# EAGLE design CargadorMonitor (EAGLE 7.7.0)
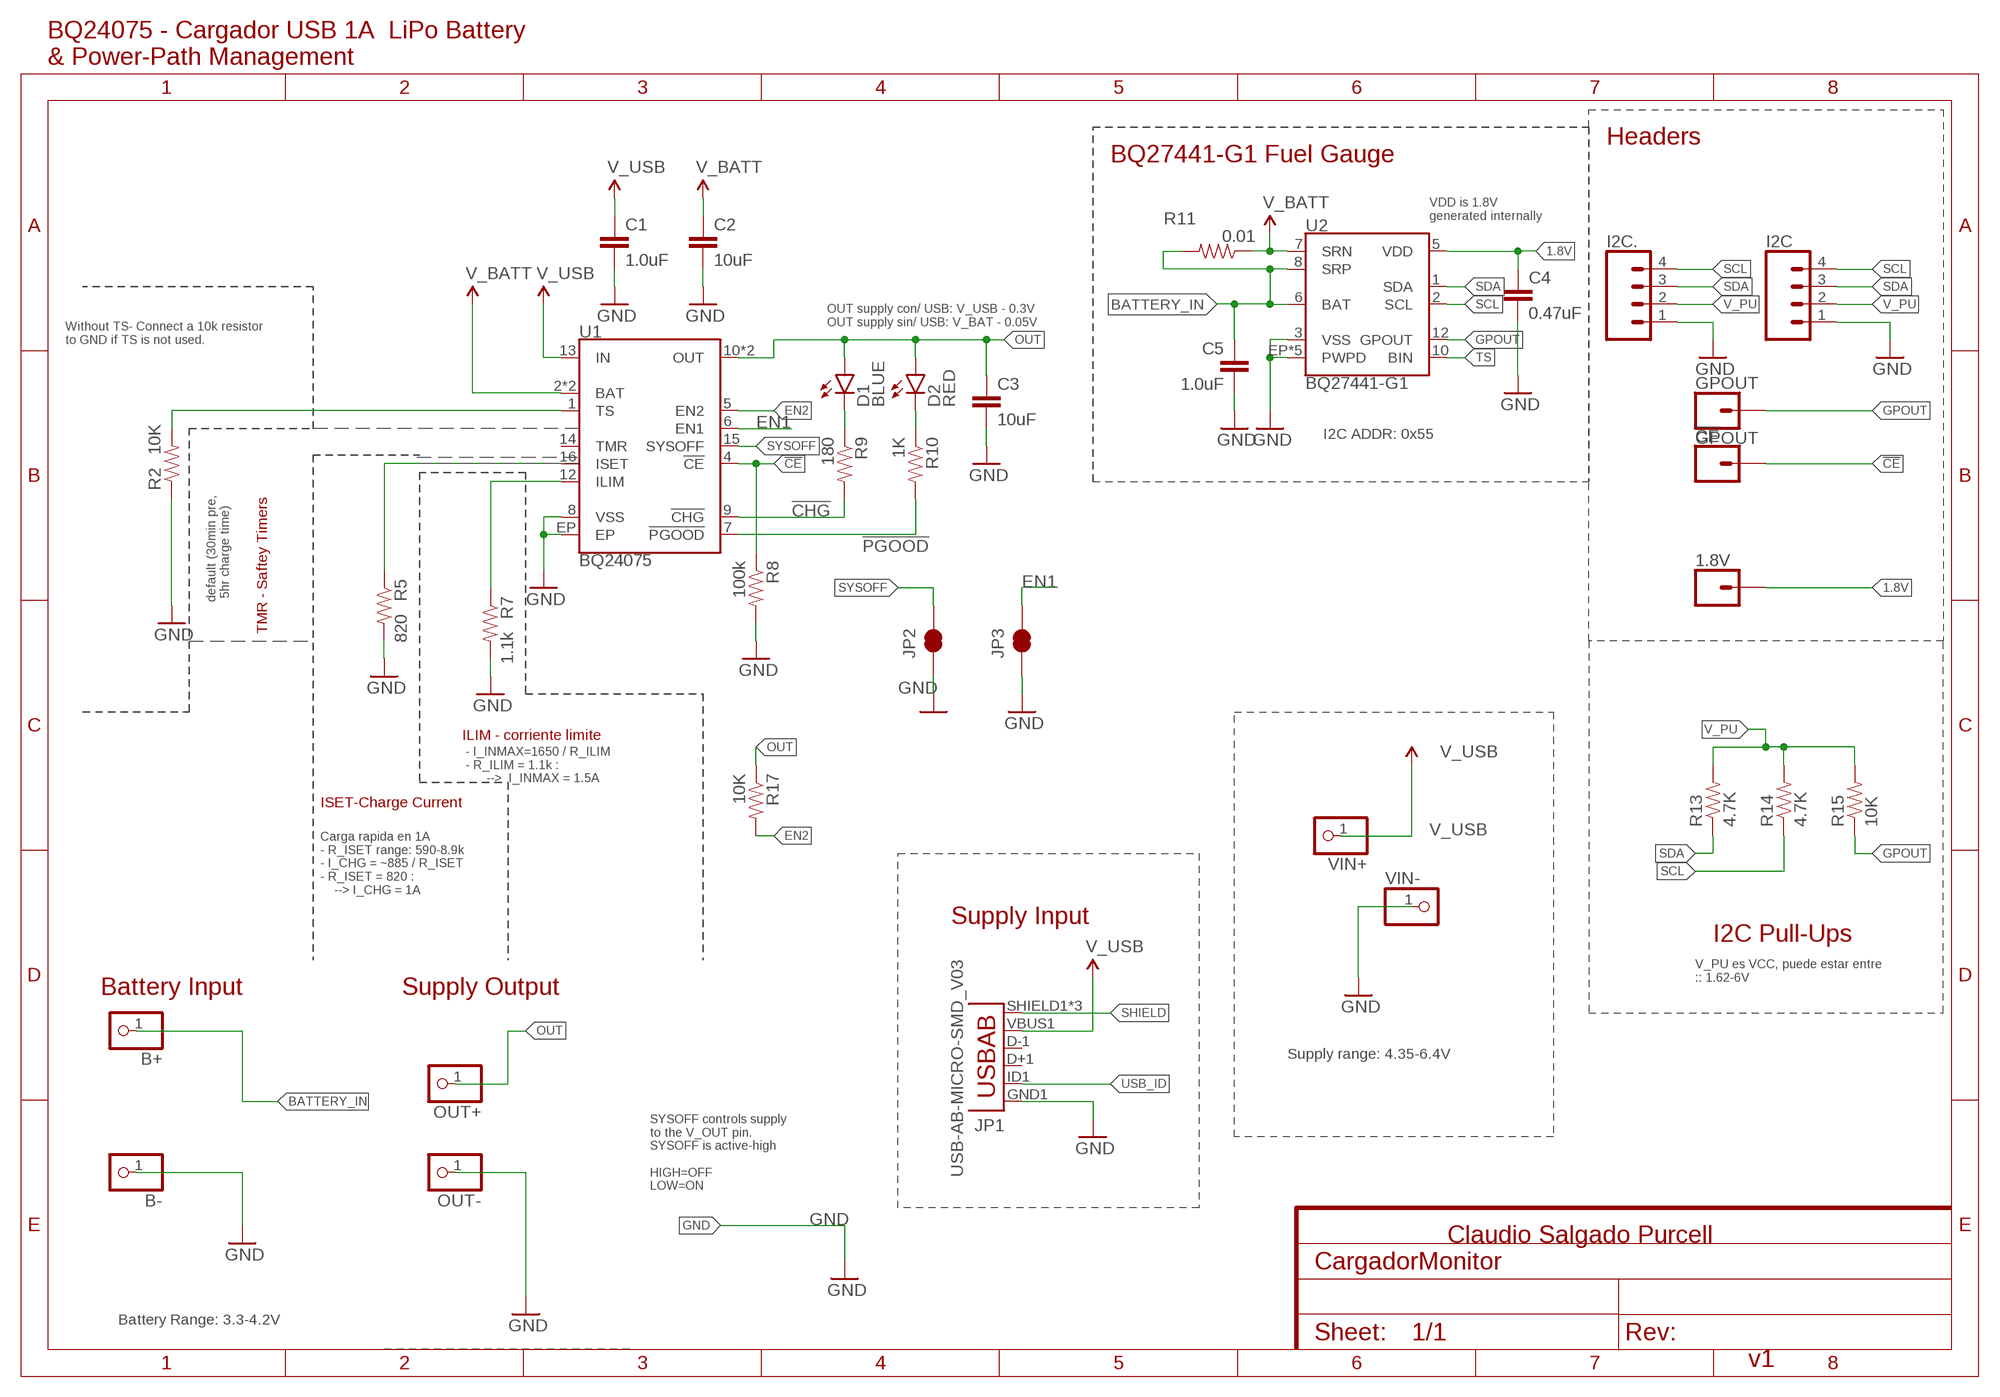
[diagram p0: schematic, sheet 1]

## Parts
1.8V  CONN_01PTH_NO_SILK_SMALL  [1X01_SMALL]
!CE!  CONN_01PTH_NO_SILK_SMALL  [1X01_SMALL]
B+  PINHD-1X1  [1X01]
B-  PINHD-1X1  [1X01]
C1  1.0uF  1.0UF50V10%(1206)  [1206-CAP]
C2  10uF  10UF10V10%(0805)  [0805-CAP]
C3  10uF  10UF10V10%(0805)  [0805-CAP]
C4  0.47uF  CAP0603-CAP  [0603-CAP]
C5  1.0uF  1.0UF-16V-10%(0603)  [0603-CAP]
D1  BLUE  LED-BLUE0603  [LED-0603]
D2  RED  LED-RED0603  [LED-0603]
GPOUT  GPOUT  CONN_01PTH_NO_SILK_SMALL  [1X01_SMALL]
I2C  CONN_04SMD2  [JST04_1MM_RA]
I2C.  CONN_041.27MM  [1X04_1.27MM]
JP1  USB-AB-MICRO-SMD_V03  USB-ABCONN-11794  [USB-AB-MICRO-SMD_V03]
JP2  JUMPER-SMT_2_NC_TRACE_SILK  [SMT-JUMPER_2_NC_TRACE_SILK]
JP3  JUMPER-SMT_2_NC_TRACE_SILK  [SMT-JUMPER_2_NC_TRACE_SILK]
OUT+  PINHD-1X1  [1X01]
OUT-  PINHD-1X1  [1X01]
R2  10K  10KOHM-1/10W-1%(0603)0603  [0603-RES]
R5  820  RESISTOR0603-RES  [0603-RES]
R7  1.1k  RESISTOR0603-RES  [0603-RES]
R8  100k  100KOHM-1/10W-1%(0603)  [0603-RES]
R9  180  180OHM1/10W1%(0603)  [0603-RES]
R10  1K  1KOHM-1/10W-1%(0603)  [0603-RES]
R11  0.01  RESISTOR1206  [1206]
R13  4.7K  4.7KOHM-1/10W-1%(0603)  [0603-RES]
R14  4.7K  4.7KOHM-1/10W-1%(0603)  [0603-RES]
R15  10K  10KOHM-1/10W-1%(0603)0603  [0603-RES]
R17  10K  10KOHM-1/10W-1%(0603)0603  [0603-RES]
U1  BQ24075  [PVQFN-N16]
U2  BQ27441-G1  [PDSO-N12]
VIN+  PINHD-1X1  [1X01]
VIN-  PINHD-1X1  [1X01]

## Nets
1.8V: 1.8V.P$1 C4.1 U2.5(VDD)
!CE!: !CE!.P$1 R8.1 U1.4(!CE!)
!CHG!: R9.2 U1.9(!CHG!)
!PGOOD!: R10.2 U1.7(!PGOOD!)
BATTERY_IN: B+.1 C5.1 R11.2 U2.6(BAT) U2.8(SRP)
EN1: JP3.2 U1.6(EN1)
EN2: R17.2 U1.5(EN2)
GND: B-.1 C1.2 C2.2 C3.2 C4.2 C5.2 I2C.1 I2C..1 JP1.GND1(GND) JP2.1 JP3.1 OUT-.1 R2.1 R5.2 R7.2 R8.2 U1.8(VSS) U1.EP U2.3(VSS) U2.EP1(PWPD) U2.EP2(PWPD) U2.EP3(PWPD) U2.EP4(PWPD) U2.EP(PWPD) VIN-.1
GPOUT: GPOUT.P$1 R15.1 U2.12(GPOUT)
ILIM: R7.1 U1.12(ILIM)
ISET: R5.1 U1.16(ISET)
N$11: D1.C R9.1
N$12: D2.C R10.1
OUT: C3.1 D1.A D2.A OUT+.1 R17.1 U1.10(OUT) U1.11(OUT)
SCL: I2C.4 I2C..4 R14.1 U2.2(SCL)
SDA: I2C.3 I2C..3 R13.1 U2.1(SDA)
SHIELD: JP1.SHIELD1(SHIELD) JP1.SHIELD2(SHIELD) JP1.SHIELD3(SHIELD)
SYSOFF: JP2.2 U1.15(SYSOFF)
TS: R2.2 U1.1(TS) U2.10(BIN)
USB_ID: JP1.ID1(USBID)
V_BATT: C2.1 R11.1 U1.2(BAT) U1.3(BAT) U2.7(SRN)
V_PU: I2C.2 I2C..2 R13.2 R14.2 R15.2
V_USB: C1.1 JP1.VBUS1(VBUS) U1.13(IN) VIN+.1
Unconnected: JP1.D+1(D+) JP1.D-1(D-) U1.14(TMR)

## Notes on the sheet
- BQ24075 - Cargador USB 1A  LiPo Battery  
  & Power-Path Management
- Headers
- BQ27441-G1 Fuel Gauge
- VDD is 1.8V
  generated internally
- OUT supply con/ USB: V_USB - 0.3V
  OUT supply sin/ USB: V_BAT - 0.05V
- Without TS- Connect a 10k resistor 
  to GND if TS is not used.
- I2C ADDR: 0x55
- default (30min pre, 
    5hr charge time)
- TMR - Saftey Timers
- ILIM - corriente limite
- - I_INMAX=1650 / R_ILIM
  - R_ILIM = 1.1k : 
        -->  I_INMAX = 1.5A
- ISET-Charge Current
- Carga rapida en 1A
  - R_ISET range: 590-8.9k
  - I_CHG = ~885 / R_ISET
  - R_ISET = 820 : 
      --> I_CHG = 1A
- Supply Input
- I2C Pull-Ups
- V_PU es VCC, puede estar entre
  :: 1.62-6V
- Battery Input | Supply Output
- Supply range: 4.35-6.4V
- SYSOFF controls supply 
  to the V_OUT pin.
  SYSOFF is active-high
  
  HIGH=OFF
  LOW=ON
- Claudio Salgado Purcell
- Battery Range: 3.3-4.2V
- v1

## Library data of the parts
1.8V !CE! GPOUT = SparkFun-Connectors:CONN_01: Single connection point. Often used as Generic Header-pin footprint for 0.1 inch spaced/style header connections On any of the 0.1 inch spaced packages, you can populate with these: Break Away Headers - Straight <https://www.sparkfun.com/products/116> (PRT-00116) Break Away Male Headers - Right Angle <https://www.sparkfun.com/products/553> (PRT-00553) Female Headers <https://www.sparkfun.com/products/115> (PRT-00115) Break Away Headers - Machine Pin <https://www.sparkfun.com/products/117> (PRT-00117) Break Away Female Headers - Swiss Machine Pin <https://www.sparkfun.com/products/743> (PRT-00743) This device is also useful as a general connection point to wire up your design to another part of your project. Our various solder wires solder well into these plated through hole pads. Hook-Up Wire - Assortment (Stranded, 22 AWG) <https://www.sparkfun.com/products/11375> (PRT-11375) Hook-Up Wire - Assortment (Solid Core, 22 AWG) <https://www.sparkfun.com/products/11367> (PRT-11367) View the entire wire category on our website here <https://www.sparkfun.com/categories/141> Special notes: SMTSO-256-ET is a "flush mount" nut for a 4-40 screw. We mostly use this on specialty testbeds; it is a nice way to connect hardware to your PCB at an adjustable hieght. Also note, the SNAP packages are for using a snappable style connector. We sell a baggie of snaps and they are also used on two LilyPad designs: Snap Assortment - 30 pack (male and female) <https://www.sparkfun.com/products/11347> (DEV-11347) LilyPad Arduino SimpleSnap <https://www.sparkfun.com/products/10941> (DEV-10941) LilyPad SimpleSnap Protoboard <https://www.sparkfun.com/products/10940> (DEV-10940)
B+ B- OUT+ OUT- VIN+ VIN- = adafruit:PINHD-1X1: Pin header 1x1 for 0.1" spacing With round pins
C1 = SparkFun-Capacitors:1.0UF50V10%(1206): CAP-09822; PROD_ID: CAP-09822
C2 C3 = SparkFun-Capacitors:10UF10V10%(0805): CAP-11330; PROD_ID: CAP-11330
C4 = SparkFun-Capacitors:CAP: Capacitor Standard 0603 ceramic capacitor, and 0.1" leaded capacitor.; PROD_ID: CAP-13216
C5 = SparkFun-Capacitors:1.0UF-16V-10%(0603): CAP-00868; PROD_ID: CAP-00868
D1 = SparkFun-LED:LED-BLUE: Blue LEDs for production use Various blue LEDs stocked by SparkFun production 0603 - DIO-08575 Rebel - DIO-09553 1206 - DIO-09911; PROD_ID: DIO-08575
D2 = SparkFun-LED:LED-RED: Assorted Red LEDs LilyPad 1206- DIO-09912 1206- DIO-00809 0603- DIO-00819 "SMART" means more efficient and expensive; PROD_ID: DIO-00819
I2C = SparkFun-Connectors:CONN_04: Multi connection point. Often used as Generic Header-pin footprint for 0.1 inch spaced/style header connections On any of the 0.1 inch spaced packages, you can populate with these: Break Away Headers - Straight <https://www.sparkfun.com/products/116> (PRT-00116) Break Away Male Headers - Right Angle <https://www.sparkfun.com/products/553> (PRT-00553) Female Headers <https://www.sparkfun.com/products/115> (PRT-00115) Break Away Headers - Machine Pin <https://www.sparkfun.com/products/117> (PRT-00117) Break Away Female Headers - Swiss Machine Pin <https://www.sparkfun.com/products/743> (PRT-00743) For SCREWTERMINALS and SPRING TERMINALS visit here: Screw Terimnals on SparkFun.com <https://www.sparkfun.com/search/results?term=Screw+Terminals> (5mm/3.5mm/2.54mm spacing) This device is also useful as a general connection point to wire up your design to another part of your project. Our various solder wires solder well into these plated through hole pads. Hook-Up Wire - Assortment (Stranded, 22 AWG) <https://www.sparkfun.com/products/11375> (PRT-11375) Hook-Up Wire - Assortment (Solid Core, 22 AWG) <https://www.sparkfun.com/products/11367> (PRT-11367) View the entire wire category on our website here <https://www.sparkfun.com/categories/141> Special notes: Molex polarized connector foot print use with SKU : PRT-08231 with associated crimp pins and housings. 1MM SMD Version SKU: PRT-10208; PROD_ID: CONN-10310; SF_ID: PRT-10208
I2C. = SparkFun-Connectors:CONN_04: Multi connection point. Often used as Generic Header-pin footprint for 0.1 inch spaced/style header connections On any of the 0.1 inch spaced packages, you can populate with these: Break Away Headers - Straight <https://www.sparkfun.com/products/116> (PRT-00116) Break Away Male Headers - Right Angle <https://www.sparkfun.com/products/553> (PRT-00553) Female Headers <https://www.sparkfun.com/products/115> (PRT-00115) Break Away Headers - Machine Pin <https://www.sparkfun.com/products/117> (PRT-00117) Break Away Female Headers - Swiss Machine Pin <https://www.sparkfun.com/products/743> (PRT-00743) For SCREWTERMINALS and SPRING TERMINALS visit here: Screw Terimnals on SparkFun.com <https://www.sparkfun.com/search/results?term=Screw+Terminals> (5mm/3.5mm/2.54mm spacing) This device is also useful as a general connection point to wire up your design to another part of your project. Our various solder wires solder well into these plated through hole pads. Hook-Up Wire - Assortment (Stranded, 22 AWG) <https://www.sparkfun.com/products/11375> (PRT-11375) Hook-Up Wire - Assortment (Solid Core, 22 AWG) <https://www.sparkfun.com/products/11367> (PRT-11367) View the entire wire category on our website here <https://www.sparkfun.com/categories/141> Special notes: Molex polarized connector foot print use with SKU : PRT-08231 with associated crimp pins and housings. 1MM SMD Version SKU: PRT-10208
JP1 = SparkFun-Connectors:USB-AB: This is a USB AB connector that is compatible with USB OTG. i.e. this connector can serve as a host or device; PROD_ID: CONN-11794
JP2 JP3 = SparkFun-Jumpers:JUMPER-SMT_2_NC_TRACE: Normally closed trace jumper This jumper has a trace between two pads so it's normally closed (NC). Use a razor knife to open the connection. For best results follow the IPC guidelines for cutting traces: Cutout at least 0.063 mm (0.005 in). Remove all loose material to clean up the cut area. Seal the cut with an approved epoxy. Reapply solder to reclose the connection.
R2 R15 R17 = SparkFun-Resistors:10KOHM-1/10W-1%(0603): RES-00824; PROD_ID: RES-00824
R5 = SparkFun-Passives:RESISTOR: Resistor Basic schematic elements and footprints for 0603, 1206, and PTH resistors.; PROD_ID: RES-13217
R7 = SparkFun-Passives:RESISTOR: Resistor Basic schematic elements and footprints for 0603, 1206, and PTH resistors.; PROD_ID: RES-10447
R8 = SparkFun-Resistors:100KOHM-1/10W-1%(0603): RES-07828; PROD_ID: RES-07828
R9 = SparkFun-Resistors:180OHM1/10W1%(0603): RES-08788; PROD_ID: RES-08788
R10 = SparkFun-Resistors:1KOHM-1/10W-1%(0603): RES-07856; PROD_ID: RES-07856
R11 = SparkFun-Resistors:RESISTOR: Resistor Basic schematic elements and footprints for 0603, 1206, and PTH resistors.; PROD_ID: RES-13218
R13 R14 = SparkFun-Resistors:4.7KOHM-1/10W-1%(0603): RES-07857; PROD_ID: RES-07857
U1 = SparkFun-PowerIC:BQ24075: Texas Instruments BQ24075 LiPo Battery Chargerand Power-Path Management IC The bq2407x series of devices are integrated Li-Ion linear chargers and system power path management devices targeted at space-limited portable applications. The devices operate from either a USB port or an AC adapter and support charge currents up to 1.5 A. The input voltage range with input overvoltage protection supports unregulated adapters. The USB input current limit accuracy and start up sequence allow the bq2407x to meet USB-IF inrush current specifications. Additionally, the input dynamic power management (VIN-DPM) prevents the charger from crashing incorrectly configured USB sources. Datasheet <http://www.ti.com/product/BQ24075/datasheet> SparkFun Products SparkFun Battery Babysitter <https://www.sparkfun.com/products/13777> (PRT-13777); PROD_ID: IC-13219
U2 = SparkFun-PowerIC:BQ27441-G1: Texas Instruments BQ27441-G1 LiPo Battery Fuel Gauge The Texas Instruments bq27441-G1 fuel gauge is a microcontroller peripheral that provides system-side fuel gauging for single-cell Li-Ion batteries. The device requires minimal user configuration and system microcontroller firmware development. The bq27441-G1 battery fuel gauge uses the patented Impedance Track™ algorithm for fuel gauging, and provides information such as remaining battery capacity (mAh), state-of-charge (%), and battery voltage (mV). Datasheet <http://www.ti.com/product/BQ27441-G1/datasheet> SparkFun Products SparkFun Battery Babysitter <https://www.sparkfun.com/products/13777> (PRT-13777); PROD_ID: IC-13220

## Board
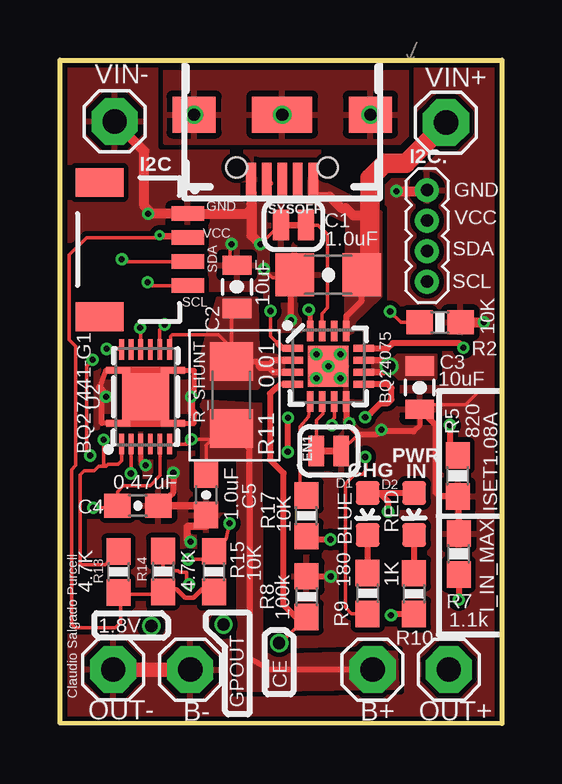
[diagram p1: board, top side]
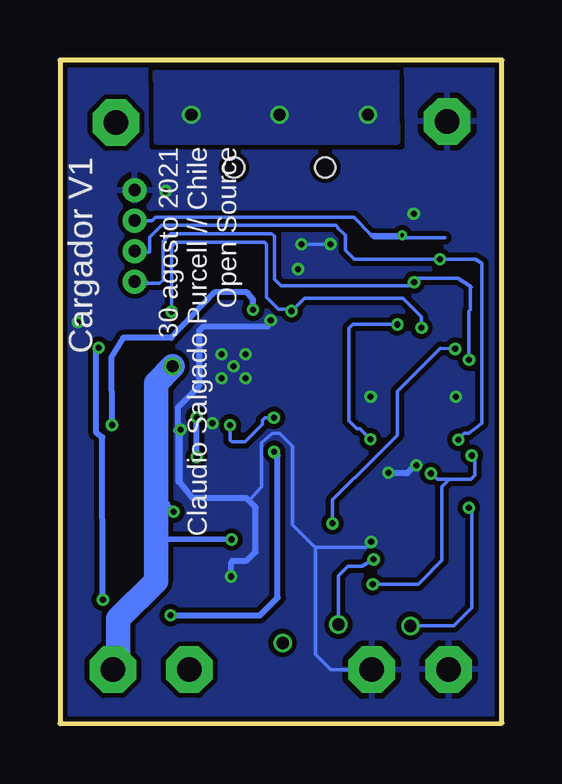
[diagram p2: board, bottom side, seen from below]

Size 18.43 x 27.65 mm. Coordinates in mm from the lower left corner, seen from the top.
Outline: 0,27.65 18.43,27.65 18.43,0 0,0.02 0,27.65
Copper layers (1*16): Top 0.035mm / dielectric 1.5mm / Bottom 0.035mm
Design rules "SparkFun-2-layer-FAB-LIMIT *": minimum track width 7mil, minimum drill 6mil, track to track 7mil, track to pad 7mil, pad to pad 7mil, via to via 7mil, smd to smd 7mil, copper to edge 7mil, drill to drill 7mil, minimum pad ring 5mil, minimum via ring 5mil, stop-mask expansion 4mil, vias tented up to drill 20mil, thermal gap 10mil

### Footprints (pad centres in the part's own frame; a part is rotated, then mirrored left to right if it is on the bottom)
1X01_SMALL = drill 0.508: P$1 0,0
1X01 = drill 1.016 pad 1.93 octagon: 1 0,0
1206-CAP = smd 1.6 x 1.8: 1 -1.4,0; 2 1.4,0
0805-CAP = smd 0.8 x 1.2: 1 -0.9,0; 2 0.9,0
0603-CAP = smd 1.1 x 1: 1 -0.85,0; 2 0.85,0
LED-0603 = smd 1 x 1: A 0,-0.877; C 0,0.877
JST04_1MM_RA = smd 0.6 x 1.35: 1 -1.5,0; 2 -0.5,0; 3 0.5,0; 4 1.5,0 | smd 1.2 x 2: NC1 2.8,-3.675; NC2 -2.8,-3.675
1X04_1.27MM = drill 0.508 pad 1: 1 0,0; 2 1.27,0; 3 2.54,0; 4 3.81,0
USB-AB-MICRO-SMD_V03 = smd 1.4 x 0.4: D+1 2.7,0; D-1 2.7,0.65; GND1 2.7,-1.3; ID1 2.7,-0.65; VBUS1 2.7,1.3 | smd 1.5 x 1.8: SHIELD1 0,3.68; SHIELD3 0,-3.68 | smd 1.5 x 2.5: SHIELD2 0,0 | hole 0.85: 2.2,1.9; 2.2,-1.9
SMT-JUMPER_2_NC_TRACE_SILK = smd 0.66 x 1.27: 1 -0.521,0; 2 0.521,0
0603-RES = smd 1.1 x 1: 1 -0.85,0; 2 0.85,0
1206 = smd 1.6 x 1.8: 1 -1.4,0; 2 1.4,0
PVQFN-N16 = smd 0.28 x 0.85: 1 -0.75,-1.475; 2 -0.25,-1.475; 3 0.25,-1.475; 4 0.75,-1.475; 9 0.75,1.475; 10 0.25,1.475; 11 -0.25,1.475; 12 -0.75,1.475 | smd 0.85 x 0.28: 5 1.475,-0.75; 6 1.475,-0.25; 7 1.475,0.25; 8 1.475,0.75; 13 -1.475,0.75; 14 -1.475,0.25; 15 -1.475,-0.25; 16 -1.475,-0.75 | smd 1.7 x 1.7: EP 0,0
PDSO-N12 = smd 0.2 x 0.85: 1 -1,-1.975; 2 -0.6,-1.975; 3 -0.2,-1.975; 4 0.2,-1.975; 5 0.6,-1.975; 6 1,-1.975; 7 1,1.975; 8 0.6,1.975; 9 0.2,1.975; 10 -0.2,1.975; 11 -0.6,1.975; 12 -1,1.975 | smd 1.95 x 1.95: EP 0,0 | smd 1 x 0.25: EP1 -1.15,1.1; EP2 -1.15,-1.1; EP3 1.15,-1.1; EP4 1.15,1.1

### Placement (x,y rotation side)
1.8V  3.81,4.07 0 top
!CE!  9.14,3.36 0 top
B+  13.04,2.25 0 top
B-  5.43,2.25 0 top
C1  11.19,18.7 180 top
C2  7.38,18.2 90 top
C3  15,14 270 top
C4  3.25,9.08 0 top
C5  6.1,9.54 270 top
D1  12.83,8.73 180 top
D2  14.77,8.73 180 top
GPOUT  6.82,4.13 0 top
I2C  5.33,19.75 270 top
I2C.  15.31,22.23 270 top
JP1  9.27,25.37 270 top
JP2  9.74,20.77 0 top
JP3  11.21,11.36 180 top
OUT+  16.22,2.25 0 top
OUT-  2.22,2.26 0 top
R2  15.85,16.71 180 top
R5  16.59,10.32 270 top
R7  16.62,7.07 90 top
R8  10.29,5.29 90 top
R9  12.83,5.43 270 top
R10  14.77,5.42 270 top
R11  7.15,13.7 270 top
R13  2.44,6.32 270 top
R14  4.3,6.34 270 top
R15  6.42,6.33 270 top
R17  10.28,8.66 90 top
U1  11.19,14.89 270 top
U2  3.57,13.62 0 top
VIN+  16.1,25.04 0 top
VIN-  2.28,25.09 0 top

### Tracks (layer width: path | path; a pad name or v marks a point on that pad's centre or on a via)
1.8V  (via drill 0.25)
  Top 0.15: U2.5 4.18,10.34 3.75,9.91 2.64,9.91 2.4,9.67 C4.1 2.32,9 v1.38,9
  Bottom 0.15: 1.8V.P$1 2,4.07 1.25,4.82 1.25,8.97 v1.38,9
!CE!
  Top 0.15: !CE!.P$1 9.32,3.47 R8.1
  Top 0.203: U1.4 9.17,14.14 9.03,14
  Top 0.254: 9.03,14 8.97,13.94 8.95,13.94 8.76,13.75 8.76,11 9.33,10.43 | R8.1 9.84,4.44 9.33,4.95 9.33,10.43 | 9.33,10.43 9.34,10.44
!CHG!  (via drill 0.25)
  Top 0.15: R9.2 12.17,4.58 11.9,4.84 11.9,10 12.3,10.4 12.61,10.4 12.76,10.55 12.76,11.08 v12.73,11.11 12.83,10.99
  Top 0.254: v12.73,12.77 12.95,12.93 13.37,13.35 13.68,13.35 13.83,13.5 13.83,13.99 13.68,14.14 U1.9
  Bottom 0.254: v12.73,11.11 v12.73,12.77
!PGOOD!  (via drill 0.25)
  Top 0.15: v11.34,12.43 11.34,12.63 11.45,12.74 U1.7
  Top 0.254: R10.2 13.99,4.56 v13.81,4.51 | v9.5,11.32 9.5,12.54 v9.51,12.75
  Bottom 0.15: v9.51,12.75 9.87,12.75 9.98,12.64 9.98,12.47 10.71,11.74 11.26,11.74 11.33,11.81 v11.33,12.42 v11.34,12.43
  Bottom 0.254: v13.81,4.51 10.09,4.51 9.35,5.25 9.35,11.17 v9.5,11.32
BATTERY_IN  (via drill 0.25)
  Top 0.15: U2.8 4.15,16.2 4.15,16.42 v4.36,16.63 | U2.6 5.27,11.64 | 5.27,11.64 v5.48,11.85 6.36,11.85 | 6.36,11.85 6.71,11.85 R11.2 | 5.27,11.64 5.27,11.72 5.45,11.9 5.47,11.9 5.5,11.87 5.53,11.87 | C5.1 6.1,11.59 6.36,11.85
  Top 0.254: B+.1 8.77,2.25 7.93,2.7 7.93,9.23 7.9,9.65 7.9,11.45 7.15,12.2 R11.2
  Bottom 0.15: v5.48,11.85 5.92,12.3 6.05,12.3 6.38,12.62 6.38,16.47 6.22,16.63 v4.36,16.63
  pour Top (isolate 0.203, no thermals): 14.07,1.52 14,2.95 8.66,2.81 8.39,3.06 8.37,13.27 5.9,13.41 5.92,11.13 7.45,11.05 7.44,1.41
EN1
  Top 0.15: U1.6 10.96,13.39 10.96,12.91 10.69,12.64 JP3.2
EN2
  Top 0.15: 10.44,9.66 R17.2 | 9.97,9.82 R17.2 | U1.5 10.36,12.79 10.01,12.36 10.01,9.78 R17.2
  Top 0.254: 10.24,9.46 R17.2
GND  (via drill 0.25)
  Top 0.15: 8.09,21.87 7.99,21.27 | VIN-.1 2.28,25.02 | 17.52,13.89 16.91,13.28 15.18,13.28 C3.2 | C2.2 7.31,19.09 7.1,19.31 7.1,19.93 v7.15,19.98 | JP3.1 12.44,12.06 | 11.94,12.68 11.94,12.55 v12.08,12.52 | JP2.1 9.16,20.77 v8.36,19.97 | 9.67,18.58 8.87,18.58 v8.51,18.94
  Top 0.178: 5.6,13.95 5.58,13.95 5.58,13.77 v5.47,13.62 | 15.28,22.15 15.36,22.13 I2C..1
  Top 0.2: 15.26,13.1 C3.2 15,12.42 14.76,12.18
  Top 0.203: U2.EP1 1.9,14.72 1.65,14.01 | U2.EP4 5.6,14.72 5.6,13.95 5.6,13.87 | U2.EP3 5.6,12.52 5.6,12.92 | U2.EP2 1.75,12.52 | U2.3 3.37,10.96 v3.57,10.76
  Top 0.254: U2.EP1 3.57,14.72 | U1.8 11.94,12.68 | R7.2 16.66,7.95 R5.2 15.83,9.47 15.67,9.63 15.67,12.43 C3.2 | 13.6,12.22 v13.4,12.24 | 12.15,12.44 v12.08,12.52 12.02,12.48 12.44,12.06 13.22,12.06 v13.4,12.24 | R8.2 v11.3,6.14 v11.29,6.13 | 10.17,19.47 10.17,19.08 C1.2 9.67,18.58 9.64,18.55 v9.64,16.8 | v4.73,10.45 4.71,9.6 C4.2 | 1.75,12.52 1.75,13.45 v1.92,13.62 | 14.76,12.18 13.46,12.18 v13.4,12.24
  Top 0.305: 1.65,14.01 v1.92,13.62 | v5.47,13.62 5.47,13.05 5.6,12.92 | C4.2 5.71,9.08 C5.2 6.1,8.22 5.35,8.22 5.31,8.18 5.31,7.71 v5.45,7.57
  Top 0.406: JP1.GND1 7.98,21.65 7.99,21.45 | 7.99,21.45 7.99,21.27 7.99,20.34 v8.36,19.97 | VIN-.1 3.52,23.85 3.52,21.57 3.84,21.25 I2C.1 7.78,21.25 7.99,21.45 | R2.1 17.71,16.71 16.62,16.71 | 15.38,22.19 15.38,22.25 15.29,22.25 15.29,22.15 15.28,22.15 15.28,22.16 | v14.03,22.19 15.27,22.19 I2C..1
  Top 0.61: B-.1 OUT-.1
  Top 0.813: 5.77,2.17 B-.1
  Bottom 0.15: v8.36,19.97 7.32,19.97 7.31,19.98 v7.15,19.98 | 7.72,7.35 7.8,7.35 8.73,8.28 8.73,11.55 9.27,12.09 9.56,12.09 10.02,11.7 10.02,9.87 10.54,9.28 | v5.45,7.57 5.67,7.35 7.72,7.35 | 7.72,7.35 7.77,7.3 7.77,2.89 7.13,2.25 B-.1
  Bottom 0.2: 13.54,12.28 v13.4,12.24
  Bottom 0.254: v11.29,6.13 11.29,6.72 11.24,6.79 10.64,6.79 10.27,7.16 10.27,9.01 10.54,9.28 10.66,9.4 12.9,9.4 13.46,10.1 | 13.6,12.22 v13.4,12.24 13.52,12.36 13.52,13.17 12.63,14.06 12.63,16.36 12.44,16.55 9.77,16.55 9.66,16.66 9.66,16.78 v9.64,16.8 | v3.57,10.76 3.63,10.76 3.96,10.43 4.71,10.43 v4.73,10.45
  Bottom 0.305: 13.46,10.1 13.46,12.04 v13.4,12.24
  other vias: 11.19,14.89 11.69,15.39 11.69,14.39 10.69,14.39 10.69,15.39 3.68,21.25 17.68,16.72
  pour Top (isolate 0.203, rank 6): 0.02,27.6 -0.13,0.19 18.36,0 18.51,27.41
  pour Bottom (isolate 0.203, rank 6): 0.03,27.52 0.03,-0.05 18.4,-0.02 18.4,27.55
GPOUT  (via drill 0.25)
  Top 0.15: v7.07,8.34 6.93,7.69 R15.1 | 6.34,7.1 R15.1 | 6.37,7.13 R15.1 | v5.35,6.84 6.08,6.84 R15.1
  Top 0.203: U2.12 v1.95,15.61
  Bottom 0.15: v1.95,15.61 2.57,15.63 4.36,13.84 4.36,12.02 5.23,11.15 5.24,11.15 7.07,9.32 v7.07,8.34 | GPOUT.P$1 6.82,6.16 6.43,6.55 5.83,6.55 v5.35,6.84
ILIM  (via drill 0.25)
  Top 0.254: R7.1 16.62,5.3 v16.64,5.16 | v16.82,15.66 v16.82,15.67 16.64,15.85 13.88,15.85 13.64,15.61 12.69,15.61 U1.12
  Bottom 0.254: v16.64,5.16 16.66,11.94 16.91,12.11 16.91,15.67 v16.82,15.66
ISET  (via drill 0.25)
  Top 0.203: U1.16 10.44,17.18 v10.38,17.24
  Top 0.254: v16.26,12.44 16.26,11.57 R5.1
  Bottom 0.254: v10.38,17.24 10.38,17.66 10.63,17.97 11.99,17.97 13.79,16.07 15.8,16.07 16.29,15.26 16.28,12.46 v16.26,12.44
N$11
  Top 0.254: D1.C R9.1
N$12
  Top 0.254: D2.C R10.1
OUT  (via drill 0.25, 0.51)
  Top 0.254: D1.A 13.33,9.61 | 13.33,9.61 D2.A | R17.1 10.4,7.69 11.1,7.69 v11.28,7.67 | v13.69,8.83 13.69,9.25 13.33,9.61
  Top 0.279: U1.11 13.48,15.14 v13.73,14.89 13.48,14.64 U1.10
  Bottom 0.2: 14.46,11.46 14.43,11.49
  Bottom 0.254: 14.43,8.67 13.96,9.14 13.96,9.1 v13.69,8.83 | v11.28,7.67 14.13,7.68 14.43,7.38
  Bottom 1.016: v13.73,14.89 14.43,14.19 14.43,11.49 14.43,8.67 14.43,7.38 14.43,5.94 16,4.37 16,2.28 OUT+.1
  pour Top (isolate 0.305, no thermals): 13.1,15.27 14.05,15.27 14.17,15.4 15.63,15.4 15.63,14.38 14.11,14.38 13.98,14.51 13.1,14.51
SCL  (via drill 0.25)
  Top 0.15: 1.11,11.1 v1.26,11.17 1.11,11.32 1.11,14.9 v1.37,15.16 | I2C.4 3.8,18.25 v3.66,18.39 | U2.2 2.97,10.69 v2.96,10.42 | R14.1 4.31,6.5 4.32,6.5 4.45,6.37 4.93,6.37 4.99,6.31 5.29,6.31 5.29,5.91 v5.39,5.81
  Bottom 0.15: 2.2,10.18 1.3,10.18 1.13,10.35 1.13,11.04 v1.26,11.17 | 2.2,10.18 2.51,9.87 2.51,6.8 2.95,6.36 2.95,6.35 3.49,5.81 v5.39,5.81 5.18,5.89 | v2.96,10.42 2.7,10.19 2.2,10.18 | 14.86,18.34 14.82,18.34 14.27,18.34 14.13,18.48 14.13,20.1 13.82,20.41 9.6,20.41 9.49,20.3 9.49,18.52 9.22,18.25 3.8,18.25 v3.66,18.39 3.78,18.55 1.83,18.55 1.32,18.23 1.28,18.19 1.31,18.16 1.31,17.24 1.37,17.18 v1.37,15.16
  Bottom 0.178: I2C..4 15.18,18.39 14.82,18.39 14.82,18.34
SDA  (via drill 0.25)
  Top 0.15: v1.82,11.83 1.82,10.82 1.93,10.71 | v2.58,19.35 2.68,19.25 I2C.3 | U2.1 2.57,10.95 2.43,10.81 2.02,10.81 1.93,10.71 | 1.93,10.71 1.61,10.71 1.43,10.54 1,10.54 0.84,10.37 0.84,6.76 0.82,6.62 1.89,6.62 R13.1
  Top 0.254: 2.11,7.5 R13.1
  Bottom 0.15: v1.82,11.83 1.56,12.09 1.38,12.09 0.83,12.51 0.83,19.19 1.1,19.35 v2.58,19.35 6.15,19.35 6.52,19.72 6.52,20.34 6.83,20.65 6.83,20.66 6.93,20.76 14.19,20.76 14.69,20.26 14.69,19.66 14.72,19.63 15.25,19.63 I2C..3
SHIELD  (via drill 0.51)
  other vias: 5.59,25.37 12.95,25.37 9.27,25.37
  pour Bottom (isolate 0.305): 4.4,27.59 4.36,24.21 14.4,24.21 14.44,27.59
  pour Top (isolate 0.305): 14.44,27.59 14.44,24.19 4.4,24.21 4.4,27.61
SYSOFF
  Top 0.15: JP2.2 10.77,20.77 11.16,20.38 11.16,17.32 10.92,17.08 10.92,16.39 U1.15
TS  (via drill 0.25)
  Top 0.15: R2.2 14.22,16.71 v13.77,17.17 | v8.78,17.19 8.78,16.15 9.08,15.85 | U2.10 3.37,16.48 v3.35,16.5
  Top 0.254: U1.1 9.29,15.64 9.08,15.85
  Bottom 0.15: 13.73,17.17 v13.77,17.17 v13.78,17.18 13.78,19.86 13.59,20.05 9.9,20.05 9.81,19.96 9.81,17.76 9.31,17.26 8.85,17.26 v8.78,17.19 8.24,17.73 4.13,17.73 3.35,16.95 v3.35,16.5
USB_ID
  Top 0.203: JP1.ID1 8.79,22.51
V_BATT
  Top 0.15: R11.1 7.15,15.67 | 7.15,15.67 7.15,17.21 C2.1 7.23,17.04 | U2.7 4.61,15.64 4.61,16.14 4.68,16.21 6.61,16.21 7.15,15.67
  Top 0.254: R11.1 8.18,15.09 8.38,14.9
  Top 0.279: U1.2 8.9,15.14 8.65,14.89 8.9,14.64 U1.3
  Top 0.406: 8.65,14.89 8.38,14.9
  pour Top (isolate 0.203, no thermals): 5.93,15.26 6.61,17.71 8.17,17.72 8.22,15.39 9.28,15.33 9.28,14.51 8.49,14.45 8.33,14.47 8.23,14 6.48,13.98 5.93,13.99
V_PU  (via drill 0.15)
  Top 0.15: 2.53,5.38 2.53,4.21 2.31,3.99 0.63,3.99 0.48,4.14 0.48,10.58 0.66,10.76 0.66,15.72 0.39,15.99 0.39,19.54 1.12,20.25 I2C.2 | 2.53,5.38 R13.2 | 2.53,5.38 4.19,5.38 R14.2 | R15.2
  Top 0.178: R15.2 6.29,5.59 5.93,5.59 5.58,5.24 5.22,5.24 4.87,5.59 4.33,5.59 R14.2 | v4.15,20.35 5.22,20.35 I2C.2
  Bottom 0.15: I2C..2 14.58,20.96 14.44,21.1 6.18,21.1 5.42,20.34 I2C.2 2.37,20.25
  Bottom 0.178: v4.15,20.35 5.4,20.35 5.42,20.34
V_USB
  Top 0.254: U1.13 11.94,16.97 12.59,17.62 C1.1
  Top 0.406: 10.57,22.14 JP1.VBUS1 10.57,22.05 10.66,21.96 11.26,21.96 11.74,21.48 11.92,21.48 12.21,21.19 12.92,21.19 12.93,21.18
  Top 0.813: VIN+.1 16.1,25.02 14.43,23.35 13.56,23.35 12.93,22.72 12.93,21.18 12.93,19.04 C1.1
  pour Top (isolate 0.203, no thermals): 11.95,16.03 12.01,20.91 10.34,21.71 10.45,22.78 13.35,21.3 13.35,17.81 12.25,16.74 12.09,16.01

### Text on the board
tNames: GND | SYSOFF | GND | VCC | VCC | SDA | SDA | SCL | SCL | R_SHUNT | EN1 | PWR | CHG | IN | 1.08A | I_IN_MAX | ISET | 1.8V | !CE! | Claudio Salgado Purcell | GPOUT
bNames: 30 agosto 2021 / Claudio Salgado Purcell // Chile / Open Source | Cargador V1